# EAGLE design CocoMEMJr_v1.01 (EAGLE 7.7.0)

## Sheet 1 of 4: CPU
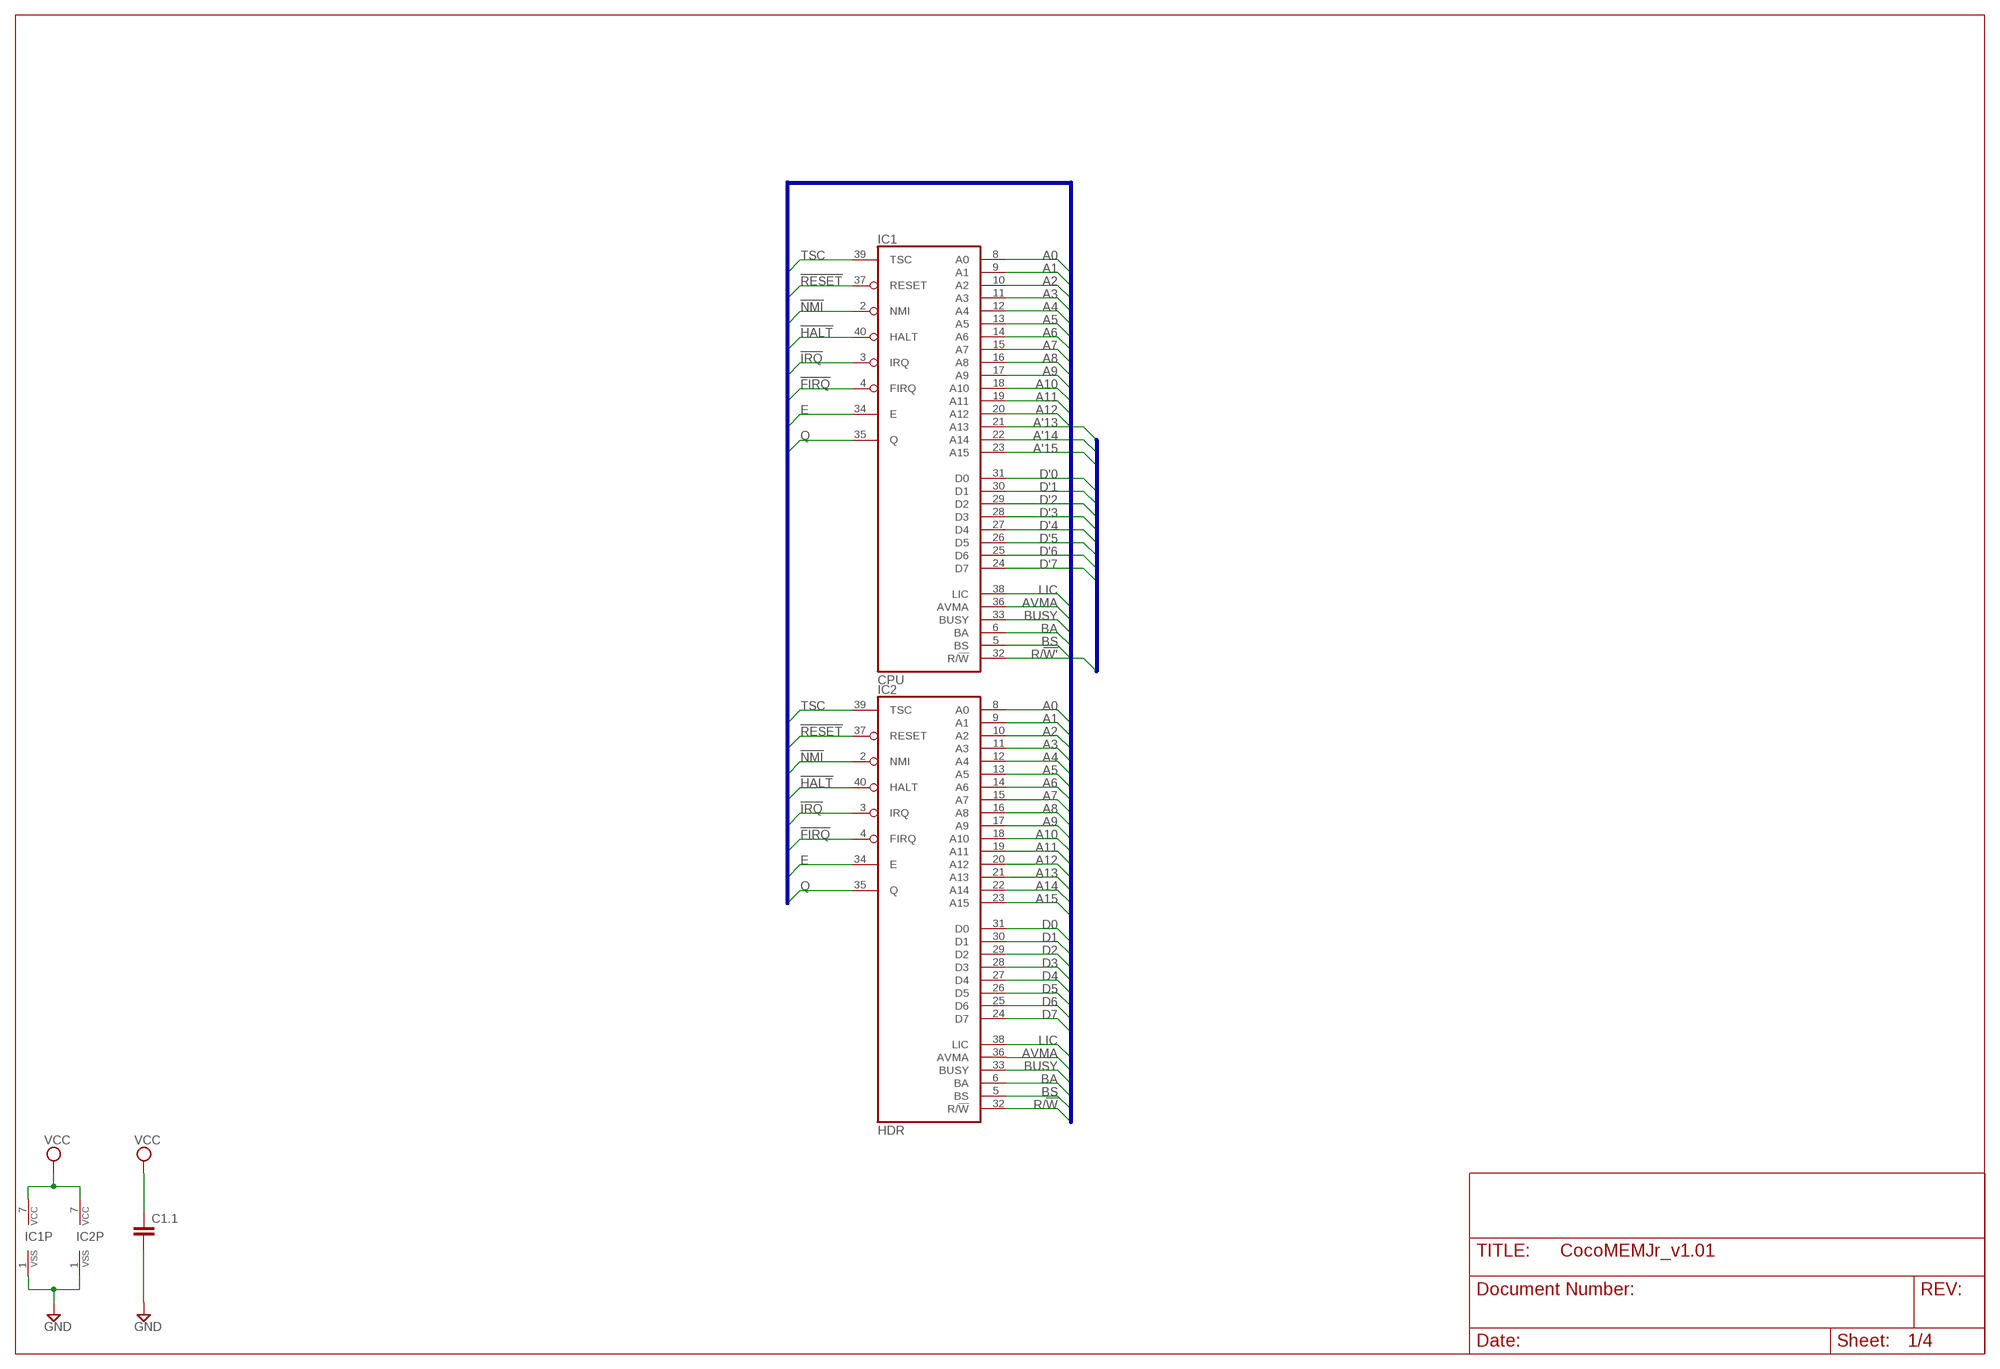
[diagram p0: schematic, sheet 1]

### Parts
C1.1  C-EUC0402  [C0402]
IC1  CPU  MC6809ER  [DIL40-ROUNDPAD]
IC2  HDR  MC6809ER  [DIL40-ROUNDPAD]

### Nets
!FIRQ: IC1.4(FIRQ) IC2.4(FIRQ) ; also sheet 2
!HALT: IC1.40(HALT) IC2.40(HALT) ; also sheet 2
!IRQ: IC1.3(IRQ) IC2.3(IRQ) ; also sheet 2
!NMI: IC1.2(NMI) IC2.2(NMI) ; also sheet 2
!RESET: IC1.37(RESET) IC2.37(RESET) ; also sheet 2
A0: IC1.8(A0) IC2.8(A0) ; also sheet 2
A1: IC1.9(A1) IC2.9(A1) ; also sheet 2
A2: IC1.10(A2) IC2.10(A2) ; also sheet 2
A3: IC1.11(A3) IC2.11(A3) ; also sheet 2
A4: IC1.12(A4) IC2.12(A4) ; also sheet 2
A5: IC1.13(A5) IC2.13(A5) ; also sheet 2
A6: IC1.14(A6) IC2.14(A6) ; also sheet 2
A7: IC1.15(A7) IC2.15(A7) ; also sheet 2
A8: IC1.16(A8) IC2.16(A8) ; also sheet 2
A9: IC1.17(A9) IC2.17(A9) ; also sheet 2
A10: IC1.18(A10) IC2.18(A10) ; also sheet 2
A11: IC1.19(A11) IC2.19(A11) ; also sheet 2
A12: IC1.20(A12) IC2.20(A12) ; also sheet 2
A13: IC2.21(A13) ; also sheet 2
A14: IC2.22(A14) ; also sheet 2
A15: IC2.23(A15) ; also sheet 2
A'13: IC1.21(A13) ; also sheet 2
A'14: IC1.22(A14) ; also sheet 2
A'15: IC1.23(A15) ; also sheet 2
AVMA: IC1.36(AVMA) IC2.36(AVMA)
BA: IC1.6(BA) IC2.6(BA) ; also sheet 2
BS: IC1.5(BS) IC2.5(BS) ; also sheet 2
BUSY: IC1.33(BUSY) IC2.33(BUSY) ; also sheet 2
D0: IC2.31(D0) ; also sheet 2
D1: IC2.30(D1) ; also sheet 2
D2: IC2.29(D2) ; also sheet 2
D3: IC2.28(D3) ; also sheet 2
D4: IC2.27(D4) ; also sheet 2
D5: IC2.26(D5) ; also sheet 2
D6: IC2.25(D6) ; also sheet 2
D7: IC2.24(D7) ; also sheet 2
D'0: IC1.31(D0) ; also sheet 2
D'1: IC1.30(D1) ; also sheet 2
D'2: IC1.29(D2) ; also sheet 2
D'3: IC1.28(D3) ; also sheet 2
D'4: IC1.27(D4) ; also sheet 2
D'5: IC1.26(D5) ; also sheet 2
D'6: IC1.25(D6) ; also sheet 2
D'7: IC1.24(D7) ; also sheet 2
E: IC1.34(E) IC2.34(E) ; also sheet 2
GND: C1.1.2 IC1.1(VSS) IC2.1(VSS) ; also sheet 2,3,4
LIC: IC1.38(LIC) IC2.38(LIC) ; also sheet 2
Q: IC1.35(Q) IC2.35(Q) ; also sheet 2
R/!W: IC2.32(R/!W) ; also sheet 2
R/!W': IC1.32(R/!W) ; also sheet 2
TSC: IC1.39(TSC) IC2.39(TSC) ; also sheet 2
VCC: C1.1.1 IC1.7(VCC) IC2.7(VCC) ; also sheet 4

### Buses
TSC,LIC,!RESET,!NMI,!HALT,!IRQ,!FIRQ,AVMA,BUSY,A[0..15],D[0..7],E,Q,BA,BS,R/!W
R/!W',D'[0..7],A'[13..15]

## Sheet 2 of 4: LOGIC
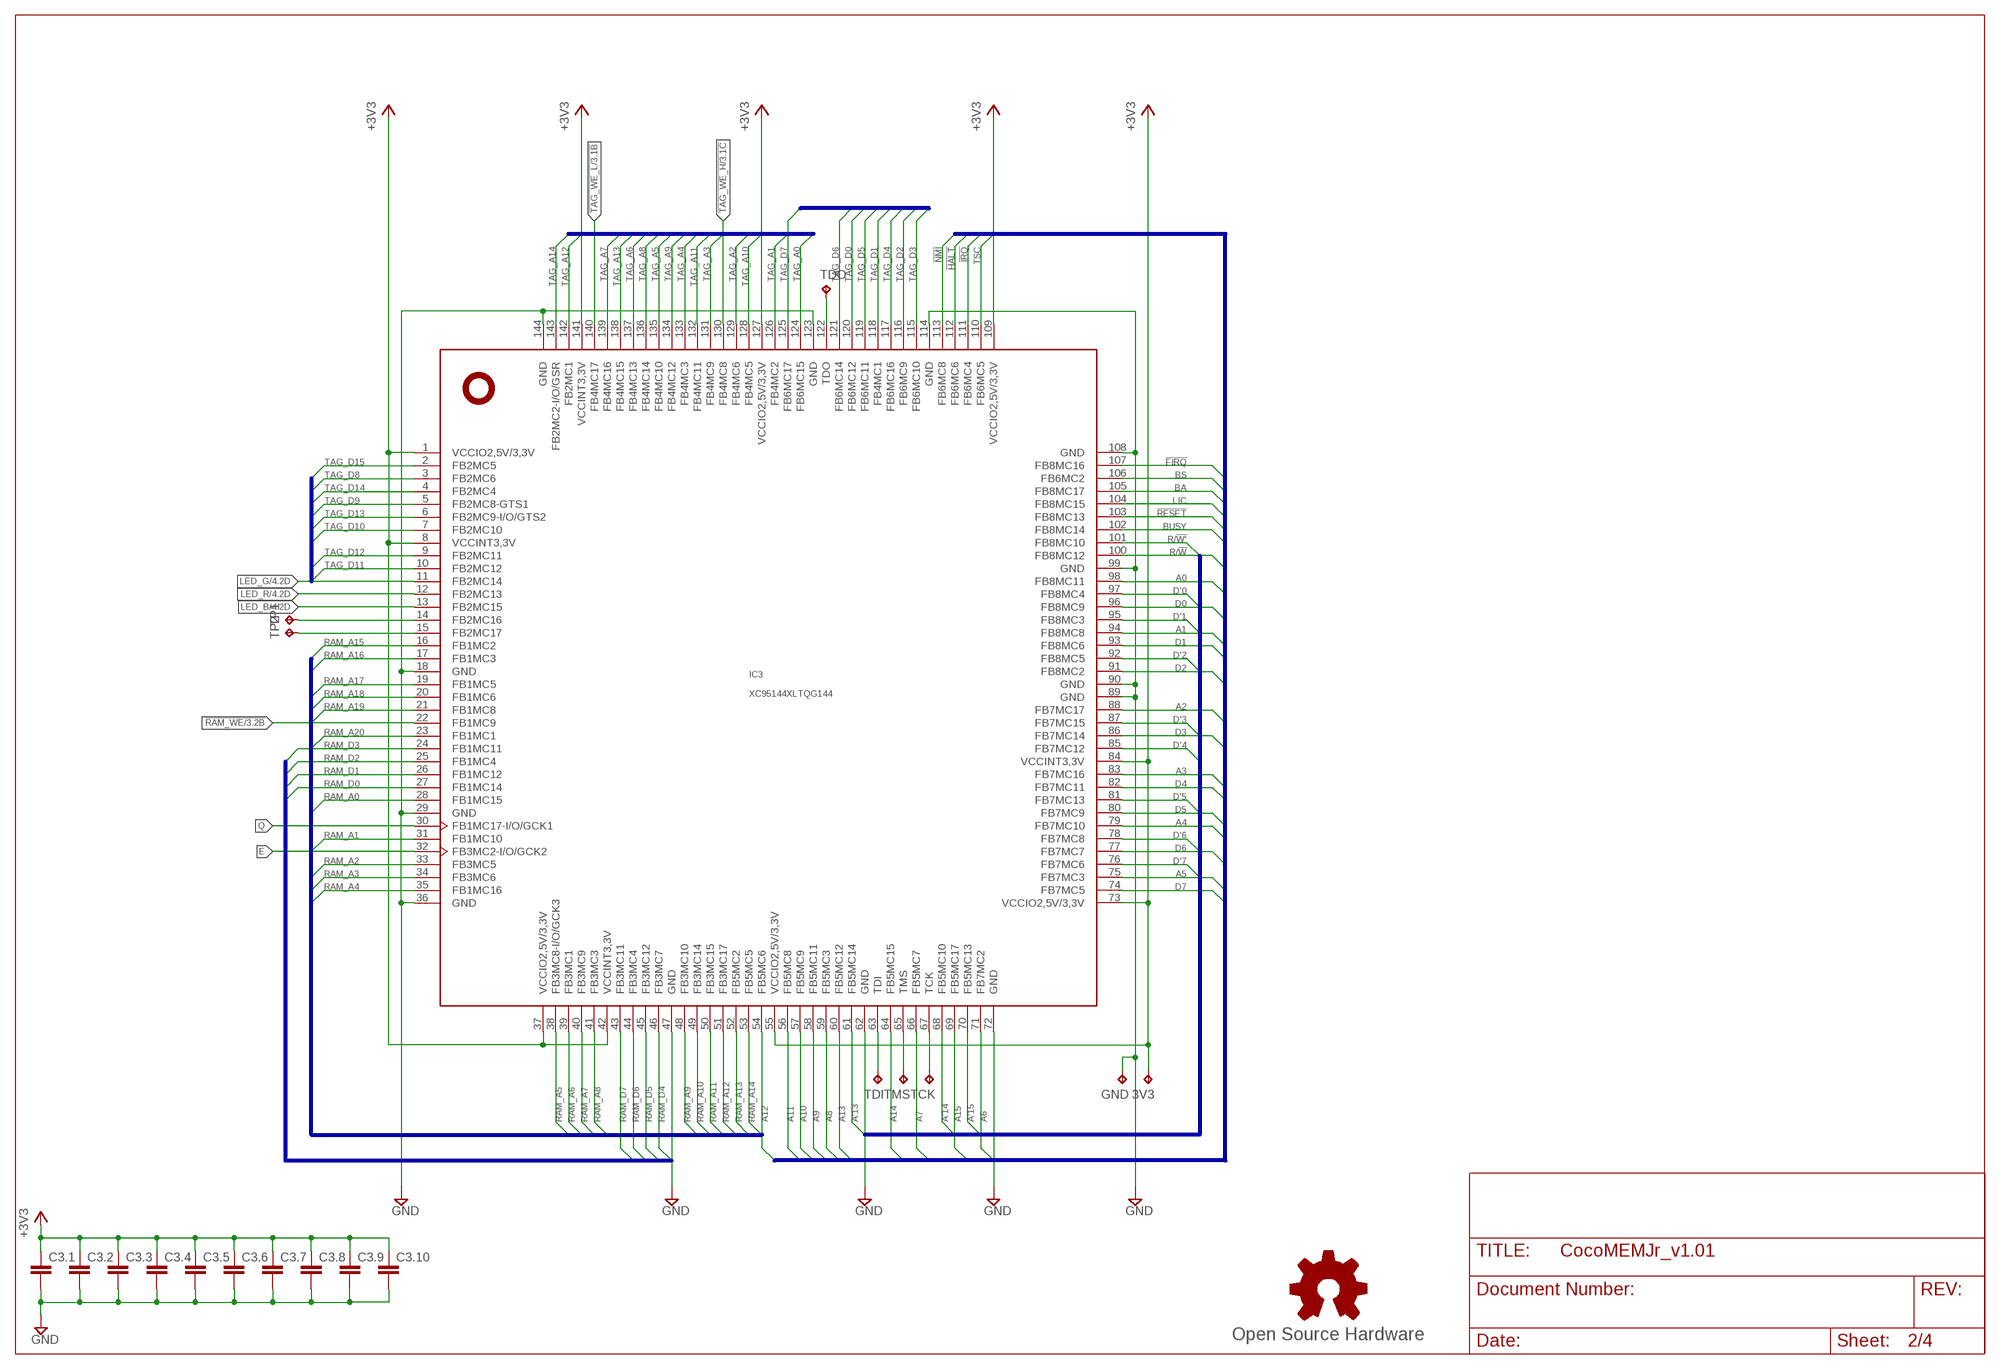
[diagram p1: schematic, sheet 2]

### Parts
3V3  TPTP08R  [TP08R]
C3.1  C-EUC0402  [C0402]
C3.2  C-EUC0402  [C0402]
C3.3  C-EUC0402  [C0402]
C3.4  C-EUC0402  [C0402]
C3.5  C-EUC0402  [C0402]
C3.6  C-EUC0402  [C0402]
C3.7  C-EUC0402  [C0402]
C3.8  C-EUC0402  [C0402]
C3.9  C-EUC0402  [C0402]
C3.10  C-EUC0402  [C0402]
GND  TPTP08R  [TP08R]
GOLD_ORB_SM1  Open Source Hardware  OSHWLOGOLOGO5MM  [OSHW_5MM]
IC3  XC95144XLTQG144  [TQFP144]
TCK  TPTP08R  [TP08R]
TDI  TPTP08R  [TP08R]
TDO  TPTP08R  [TP08R]
TMS  TPTP08R  [TP08R]
TP1  TPTP08R  [TP08R]
TP2  TPTP08R  [TP08R]

### Nets
!FIRQ: IC3.107(FB8MC16) ; also sheet 1
!HALT: IC3.112(FB6MC6) ; also sheet 1
!IRQ: IC3.111(FB6MC4) ; also sheet 1
!NMI: IC3.113(FB6MC8) ; also sheet 1
!RAM_WE: IC3.22(FB1MC9) ; also sheet 3
!RESET: IC3.103(FB8MC13) ; also sheet 1
!TAG_WE_H: IC3.130(FB4MC8) ; also sheet 3
!TAG_WE_L: IC3.140(FB4MC17) ; also sheet 3
+3V3: 3V3.TP C3.1.1 C3.2.1 C3.3.1 C3.4.1 C3.5.1 C3.6.1 C3.7.1 C3.8.1 C3.9.1 C3.10.1 IC3.1(VCCIO2,5V/3,3V) IC3.8(VCCINT3,3V) IC3.37(VCCIO2,5V/3,3V) IC3.42(VCCINT3,3V) IC3.55(VCCIO2,5V/3,3V) IC3.73(VCCIO2,5V/3,3V) IC3.84(VCCINT3,3V) IC3.109(VCCIO2,5V/3,3V) IC3.127(VCCIO2,5V/3,3V) IC3.141(VCCINT3,3V) ; also sheet 3,4
A0: IC3.98(FB8MC11) ; also sheet 1
A1: IC3.94(FB8MC8) ; also sheet 1
A2: IC3.88(FB7MC17) ; also sheet 1
A3: IC3.83(FB7MC16) ; also sheet 1
A4: IC3.79(FB7MC10) ; also sheet 1
A5: IC3.75(FB7MC3) ; also sheet 1
A6: IC3.71(FB7MC2) ; also sheet 1
A7: IC3.66(FB5MC7) ; also sheet 1
A8: IC3.59(FB5MC3) ; also sheet 1
A9: IC3.58(FB5MC11) ; also sheet 1
A10: IC3.57(FB5MC9) ; also sheet 1
A11: IC3.56(FB5MC8) ; also sheet 1
A12: IC3.54(FB5MC6) ; also sheet 1
A13: IC3.60(FB5MC12) ; also sheet 1
A14: IC3.64(FB5MC15) ; also sheet 1
A15: IC3.69(FB5MC17) ; also sheet 1
A'13: IC3.61(FB5MC14) ; also sheet 1
A'14: IC3.68(FB5MC10) ; also sheet 1
A'15: IC3.70(FB5MC13) ; also sheet 1
BA: IC3.105(FB8MC17) ; also sheet 1
BS: IC3.106(FB6MC2) ; also sheet 1
BUSY: IC3.102(FB8MC14) ; also sheet 1
D0: IC3.96(FB8MC9) ; also sheet 1
D1: IC3.93(FB8MC6) ; also sheet 1
D2: IC3.91(FB8MC2) ; also sheet 1
D3: IC3.86(FB7MC14) ; also sheet 1
D4: IC3.82(FB7MC11) ; also sheet 1
D5: IC3.80(FB7MC9) ; also sheet 1
D6: IC3.77(FB7MC7) ; also sheet 1
D7: IC3.74(FB7MC5) ; also sheet 1
D'0: IC3.97(FB8MC4) ; also sheet 1
D'1: IC3.95(FB8MC3) ; also sheet 1
D'2: IC3.92(FB8MC5) ; also sheet 1
D'3: IC3.87(FB7MC15) ; also sheet 1
D'4: IC3.85(FB7MC12) ; also sheet 1
D'5: IC3.81(FB7MC13) ; also sheet 1
D'6: IC3.78(FB7MC8) ; also sheet 1
D'7: IC3.76(FB7MC6) ; also sheet 1
E: IC3.32(FB3MC2-I/O/GCK2) ; also sheet 1
GND: C3.1.2 C3.2.2 C3.3.2 C3.4.2 C3.5.2 C3.6.2 C3.7.2 C3.8.2 C3.9.2 C3.10.2 GND.TP IC3.18(GND) IC3.29(GND) IC3.36(GND) IC3.47(GND) IC3.62(GND) IC3.72(GND) IC3.89(GND) IC3.90(GND) IC3.99(GND) IC3.108(GND) IC3.114(GND) IC3.123(GND) IC3.144(GND) ; also sheet 1,3,4
LED_B: IC3.13(FB2MC15) ; also sheet 4
LED_G: IC3.11(FB2MC14) ; also sheet 4
LED_R: IC3.12(FB2MC13) ; also sheet 4
LIC: IC3.104(FB8MC15) ; also sheet 1
N$4: IC3.14(FB2MC16) TP1.TP
N$5: IC3.63(TDI) TDI.TP
N$6: IC3.65(TMS) TMS.TP
N$7: IC3.67(TCK) TCK.TP
N$8: IC3.122(TDO) TDO.TP
N$9: IC3.15(FB2MC17) TP2.TP
Q: IC3.30(FB1MC17-I/O/GCK1) ; also sheet 1
R/!W: IC3.100(FB8MC12) ; also sheet 1
R/!W': IC3.101(FB8MC10) ; also sheet 1
RAM_A0: IC3.28(FB1MC15) ; also sheet 3
RAM_A1: IC3.31(FB1MC10) ; also sheet 3
RAM_A2: IC3.33(FB3MC5) ; also sheet 3
RAM_A3: IC3.34(FB3MC6) ; also sheet 3
RAM_A4: IC3.35(FB1MC16) ; also sheet 3
RAM_A5: IC3.38(FB3MC8-I/O/GCK3) ; also sheet 3
RAM_A6: IC3.39(FB3MC1) ; also sheet 3
RAM_A7: IC3.40(FB3MC9) ; also sheet 3
RAM_A8: IC3.41(FB3MC3) ; also sheet 3
RAM_A9: IC3.48(FB3MC10) ; also sheet 3
RAM_A10: IC3.49(FB3MC14) ; also sheet 3
RAM_A11: IC3.50(FB3MC15) ; also sheet 3
RAM_A12: IC3.51(FB3MC17) ; also sheet 3
RAM_A13: IC3.52(FB5MC2) ; also sheet 3
RAM_A14: IC3.53(FB5MC5) ; also sheet 3
RAM_A15: IC3.16(FB1MC2) ; also sheet 3
RAM_A16: IC3.17(FB1MC3) ; also sheet 3
RAM_A17: IC3.19(FB1MC5) ; also sheet 3
RAM_A18: IC3.20(FB1MC6) ; also sheet 3
RAM_A19: IC3.21(FB1MC8) ; also sheet 3
RAM_A20: IC3.23(FB1MC1) ; also sheet 3
RAM_D0: IC3.27(FB1MC14) ; also sheet 3
RAM_D1: IC3.26(FB1MC12) ; also sheet 3
RAM_D2: IC3.25(FB1MC4) ; also sheet 3
RAM_D3: IC3.24(FB1MC11) ; also sheet 3
RAM_D4: IC3.46(FB3MC7) ; also sheet 3
RAM_D5: IC3.45(FB3MC12) ; also sheet 3
RAM_D6: IC3.44(FB3MC4) ; also sheet 3
RAM_D7: IC3.43(FB3MC11) ; also sheet 3
TAG_A0: IC3.124(FB6MC15) ; also sheet 3
TAG_A1: IC3.126(FB4MC2) ; also sheet 3
TAG_A2: IC3.129(FB4MC6) ; also sheet 3
TAG_A3: IC3.131(FB4MC9) ; also sheet 3
TAG_A4: IC3.133(FB4MC3) ; also sheet 3
TAG_A5: IC3.135(FB4MC10) ; also sheet 3
TAG_A6: IC3.137(FB4MC13) ; also sheet 3
TAG_A7: IC3.139(FB4MC16) ; also sheet 3
TAG_A8: IC3.136(FB4MC14) ; also sheet 3
TAG_A9: IC3.134(FB4MC12) ; also sheet 3
TAG_A10: IC3.128(FB4MC5) ; also sheet 3
TAG_A11: IC3.132(FB4MC11) ; also sheet 3
TAG_A12: IC3.142(FB2MC1) ; also sheet 3
TAG_A13: IC3.138(FB4MC15) ; also sheet 3
TAG_A14: IC3.143(FB2MC2-I/O/GSR) ; also sheet 3
TAG_D0: IC3.120(FB6MC12) ; also sheet 3
TAG_D1: IC3.118(FB4MC1) ; also sheet 3
TAG_D2: IC3.116(FB6MC9) ; also sheet 3
TAG_D3: IC3.115(FB6MC10) ; also sheet 3
TAG_D4: IC3.117(FB6MC16) ; also sheet 3
TAG_D5: IC3.119(FB6MC11) ; also sheet 3
TAG_D6: IC3.121(FB6MC14) ; also sheet 3
TAG_D7: IC3.125(FB6MC17) ; also sheet 3
TAG_D8: IC3.3(FB2MC6) ; also sheet 3
TAG_D9: IC3.5(FB2MC8-GTS1) ; also sheet 3
TAG_D10: IC3.7(FB2MC10) ; also sheet 3
TAG_D11: IC3.10(FB2MC12) ; also sheet 3
TAG_D12: IC3.9(FB2MC11) ; also sheet 3
TAG_D13: IC3.6(FB2MC9-I/O/GTS2) ; also sheet 3
TAG_D14: IC3.4(FB2MC4) ; also sheet 3
TAG_D15: IC3.2(FB2MC5) ; also sheet 3
TSC: IC3.110(FB6MC5) ; also sheet 1

### Buses
TSC,LIC,!RESET,!NMI,!HALT,!IRQ,!FIRQ,AVMA,BUSY,A[0..15],D[0..7],E,Q,BA,BS,R/!W
R/!W',D'[0..7],A'[13..15]
RAM_D[0..7]
TAG_D[0..15]
TAG_A[0..14]
RAM_A[0..20]

## Sheet 3 of 4: MEMORY
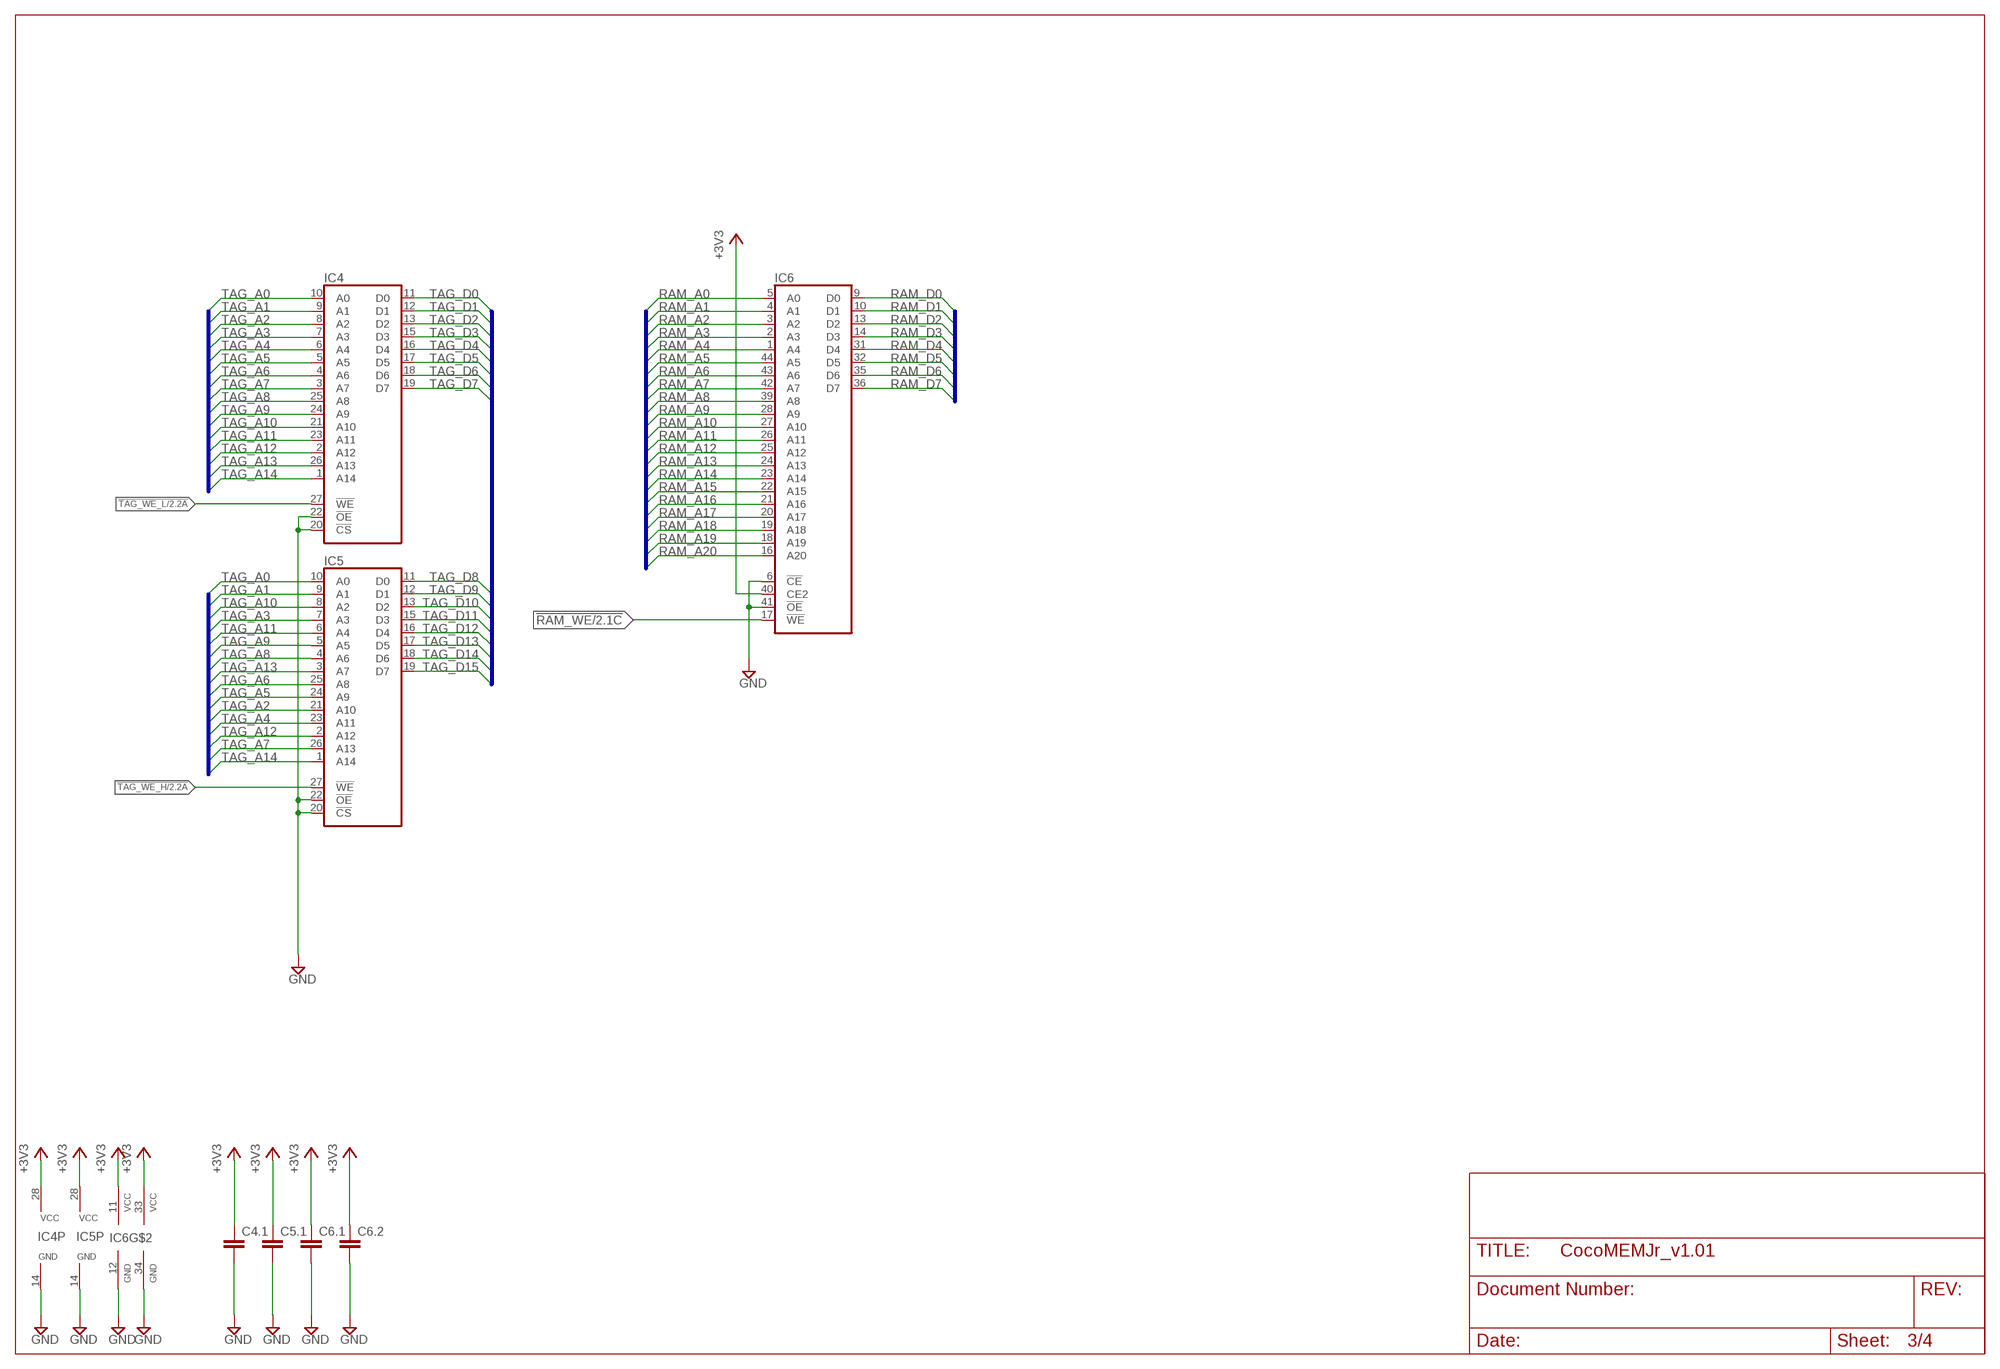
[diagram p2: schematic, sheet 3]

### Parts
C4.1  C-EUC0402  [C0402]
C5.1  C-EUC0402  [C0402]
C6.1  C-EUC0402  [C0402]
C6.2  C-EUC0402  [C0402]
IC4  JEDEC_32KB_SRAMY  [SOJ32/3]
IC5  JEDEC_32KB_SRAMY  [SOJ32/3]
IC6  AS6C1608-XXTIN  [TSOP44-II]

### Nets
!RAM_WE: IC6.17(!WE) ; also sheet 2
!TAG_WE_H: IC5.27(!WE) ; also sheet 2
!TAG_WE_L: IC4.27(!WE) ; also sheet 2
+3V3: C4.1.1 C5.1.1 C6.1.1 C6.2.1 IC4.28(VCC) IC5.28(VCC) IC6.11(VCC) IC6.33(VCC) IC6.40(CE2) ; also sheet 2,4
GND: C4.1.2 C5.1.2 C6.1.2 C6.2.2 IC4.14(GND) IC4.20(!CS) IC4.22(!OE) IC5.14(GND) IC5.20(!CS) IC5.22(!OE) IC6.6(!CE) IC6.12(GND) IC6.34(GND) IC6.41(!OE) ; also sheet 1,2,4
RAM_A0: IC6.5(A0) ; also sheet 2
RAM_A1: IC6.4(A1) ; also sheet 2
RAM_A2: IC6.3(A2) ; also sheet 2
RAM_A3: IC6.2(A3) ; also sheet 2
RAM_A4: IC6.1(A4) ; also sheet 2
RAM_A5: IC6.44(A5) ; also sheet 2
RAM_A6: IC6.43(A6) ; also sheet 2
RAM_A7: IC6.42(A7) ; also sheet 2
RAM_A8: IC6.39(A8) ; also sheet 2
RAM_A9: IC6.28(A9) ; also sheet 2
RAM_A10: IC6.27(A10) ; also sheet 2
RAM_A11: IC6.26(A11) ; also sheet 2
RAM_A12: IC6.25(A12) ; also sheet 2
RAM_A13: IC6.24(A13) ; also sheet 2
RAM_A14: IC6.23(A14) ; also sheet 2
RAM_A15: IC6.22(A15) ; also sheet 2
RAM_A16: IC6.21(A16) ; also sheet 2
RAM_A17: IC6.20(A17) ; also sheet 2
RAM_A18: IC6.19(A18) ; also sheet 2
RAM_A19: IC6.18(A19) ; also sheet 2
RAM_A20: IC6.16(A20) ; also sheet 2
RAM_D0: IC6.9(D0) ; also sheet 2
RAM_D1: IC6.10(D1) ; also sheet 2
RAM_D2: IC6.13(D2) ; also sheet 2
RAM_D3: IC6.14(D3) ; also sheet 2
RAM_D4: IC6.31(D4) ; also sheet 2
RAM_D5: IC6.32(D5) ; also sheet 2
RAM_D6: IC6.35(D6) ; also sheet 2
RAM_D7: IC6.36(D7) ; also sheet 2
TAG_A0: IC4.10(A0) IC5.10(A0) ; also sheet 2
TAG_A1: IC4.9(A1) IC5.9(A1) ; also sheet 2
TAG_A2: IC4.8(A2) IC5.21(A10) ; also sheet 2
TAG_A3: IC4.7(A3) IC5.7(A3) ; also sheet 2
TAG_A4: IC4.6(A4) IC5.23(A11) ; also sheet 2
TAG_A5: IC4.5(A5) IC5.24(A9) ; also sheet 2
TAG_A6: IC4.4(A6) IC5.25(A8) ; also sheet 2
TAG_A7: IC4.3(A7) IC5.26(A13) ; also sheet 2
TAG_A8: IC4.25(A8) IC5.4(A6) ; also sheet 2
TAG_A9: IC4.24(A9) IC5.5(A5) ; also sheet 2
TAG_A10: IC4.21(A10) IC5.8(A2) ; also sheet 2
TAG_A11: IC4.23(A11) IC5.6(A4) ; also sheet 2
TAG_A12: IC4.2(A12) IC5.2(A12) ; also sheet 2
TAG_A13: IC4.26(A13) IC5.3(A7) ; also sheet 2
TAG_A14: IC4.1(A14) IC5.1(A14) ; also sheet 2
TAG_D0: IC4.11(D0) ; also sheet 2
TAG_D1: IC4.12(D1) ; also sheet 2
TAG_D2: IC4.13(D2) ; also sheet 2
TAG_D3: IC4.15(D3) ; also sheet 2
TAG_D4: IC4.16(D4) ; also sheet 2
TAG_D5: IC4.17(D5) ; also sheet 2
TAG_D6: IC4.18(D6) ; also sheet 2
TAG_D7: IC4.19(D7) ; also sheet 2
TAG_D8: IC5.11(D0) ; also sheet 2
TAG_D9: IC5.12(D1) ; also sheet 2
TAG_D10: IC5.13(D2) ; also sheet 2
TAG_D11: IC5.15(D3) ; also sheet 2
TAG_D12: IC5.16(D4) ; also sheet 2
TAG_D13: IC5.17(D5) ; also sheet 2
TAG_D14: IC5.18(D6) ; also sheet 2
TAG_D15: IC5.19(D7) ; also sheet 2

### Buses
RAM_D[0..7]
TAG_D[0..15]
TAG_A[0..14]
RAM_A[0..20]

## Sheet 4 of 4: POWER
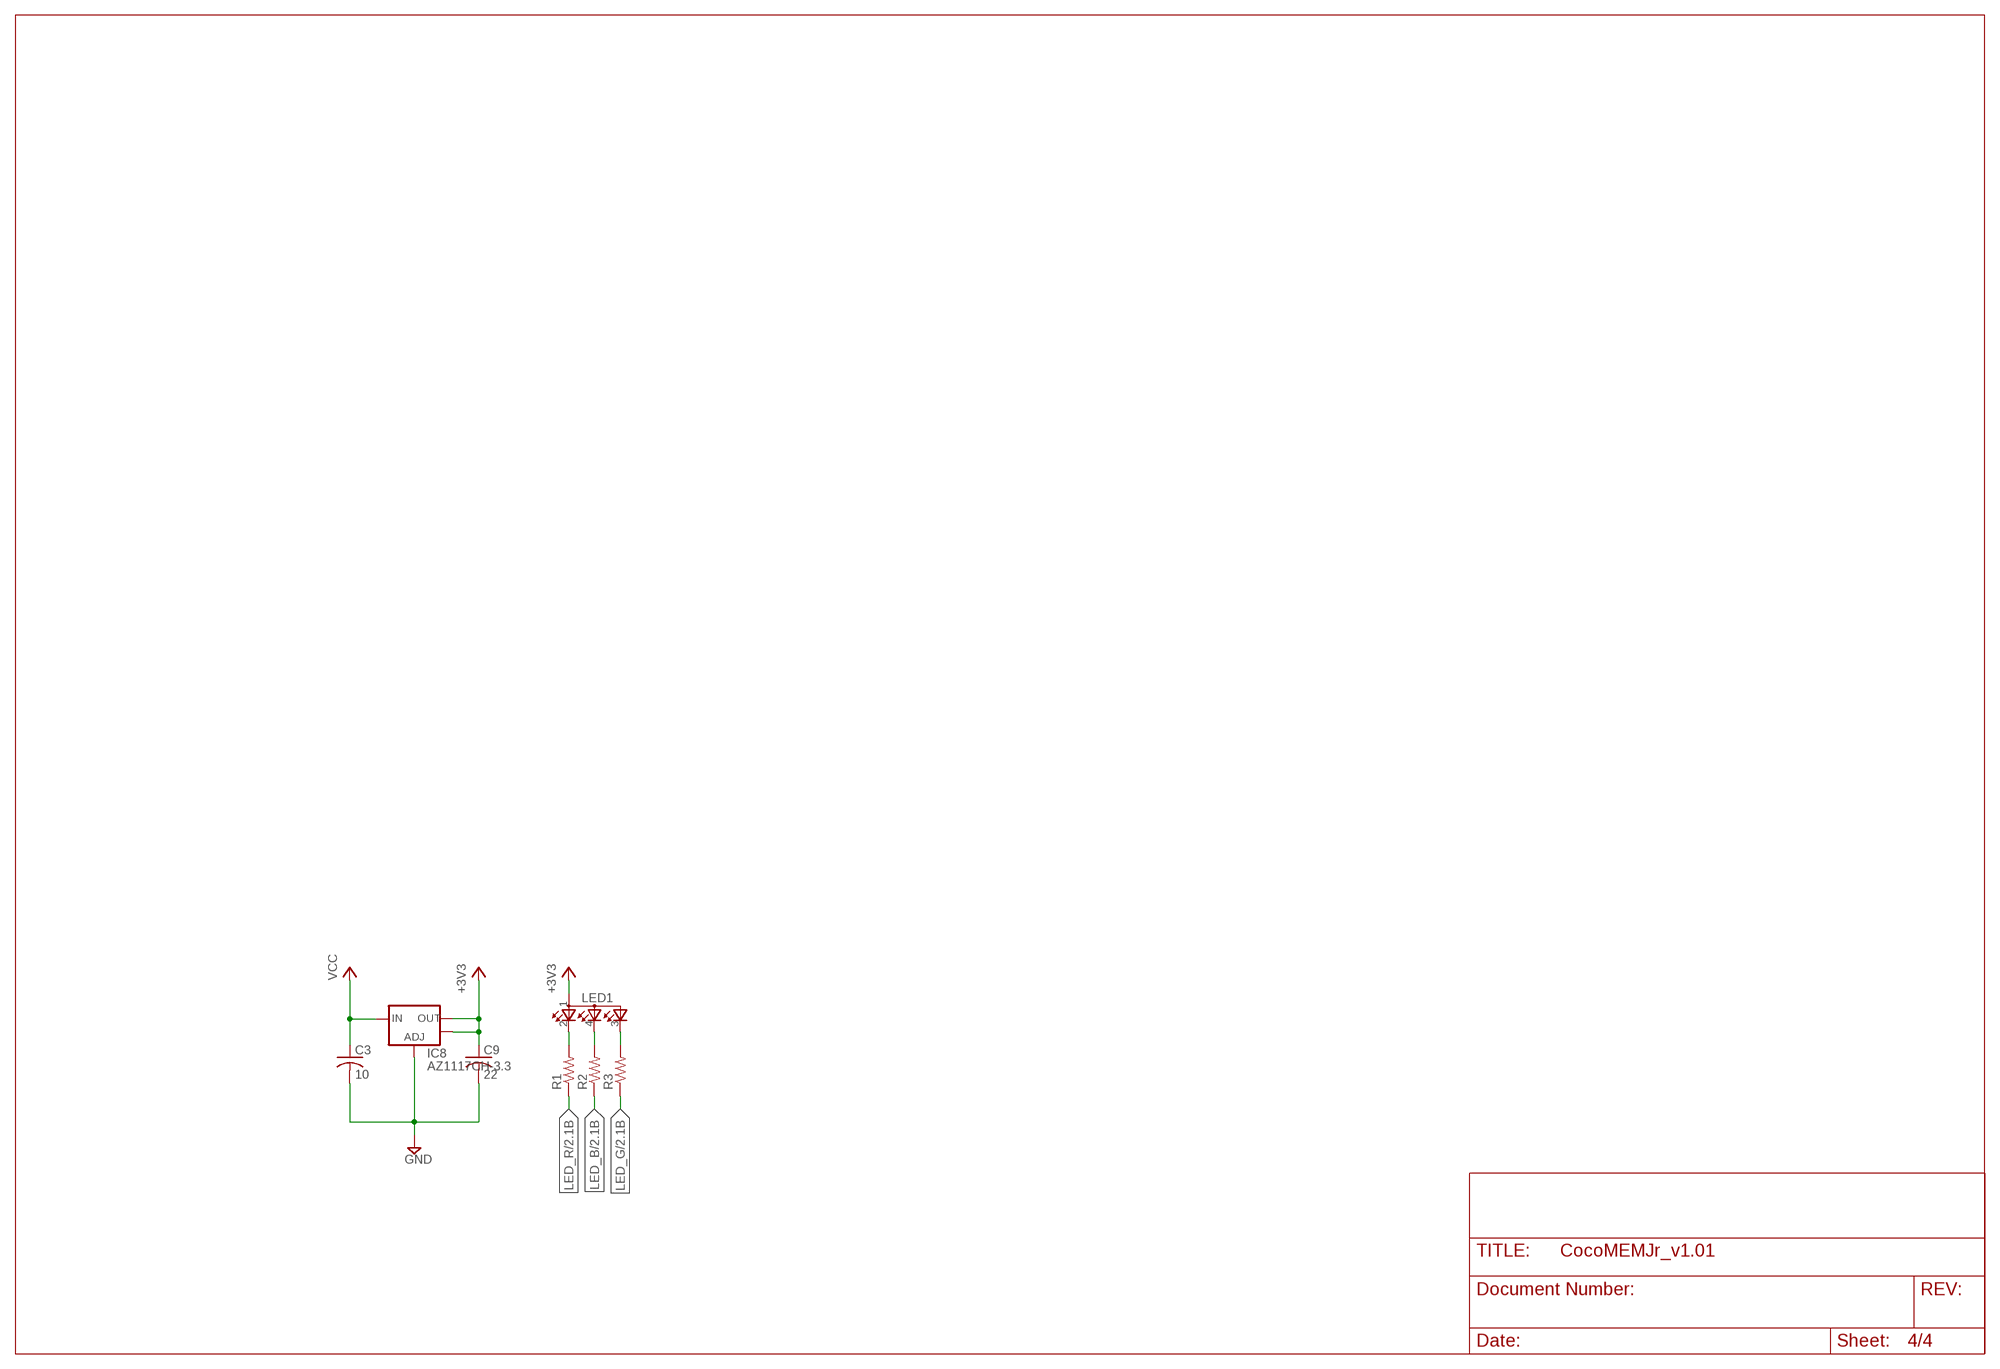
[diagram p3: schematic, sheet 4]

### Parts
C3  10  C-USC0805  [C0805]
C9  22  C-USC0805  [C0805]
IC8  AZ1117CH-3.3  V_REG_LM1117SOT223  [SOT223]
LED1  RGBLED-PLCC4  [PLCC-4]
R1  R-US_R0402  [R0402]
R2  R-US_R0402  [R0402]
R3  R-US_R0402  [R0402]

### Nets
+3V3: C9.1 IC8.2(OUT) IC8.4(OUT) LED1.1(A2) ; also sheet 2,3
GND: C3.2 C9.2 IC8.1(ADJ) ; also sheet 1,2,3
LED_B: R2.1 ; also sheet 2
LED_G: R3.1 ; also sheet 2
LED_R: R1.1 ; also sheet 2
N$1: LED1.2(CRED) R1.2
N$2: LED1.4(CBLUE) R2.2
N$3: LED1.3(CGREEN) R3.2
VCC: C3.1 IC8.3(IN) ; also sheet 1

## Library data of the parts
3V3 GND TCK TDI TDO TMS TP1 TP2 = testpad:TP: Test pad
C1.1 C3.1-C3.10 C4.1 C5.1 C6.1 C6.2 = rcl:C-EU: CAPACITOR, European symbol
C3 C9 = rcl:C-US: CAPACITOR, American symbol
GOLD_ORB_SM1 = oshw:OSHWLOGO: The OSHW logo for PCB layout
IC1 IC2 = micro-motorola:MC6809E: MICROCONTROLLER/MEMORY DEVICE
IC3 = xilinx_xc95XXXxl:XC95144XLTQG144
IC4 IC5 = memory-jedec-jlb:JEDEC_32KB_SRAM: MEMORY
IC6 = memory-alliance:AS6C1608-XX
IC8 = SparkFun:V_REG_LM1117: Voltage Regulator LM1117 Standard adjustable voltage regulator but in SMD form. Spark Fun Electronics SKU : COM-00595
LED1 = led-jlb:RGBLED-PLCC4: OSRAM - Hyper Multi TOPLED® (RGB) LB E673, LV E673, LT E673 - Power TOPLED® Enhanced optical Power LED (HOP2000) LS E67B, LA E67B, LO E67B, LY E67B - Hyper Multi TOPLED® Enhanced optical Power LED (HOP2000 / ATON®) LATB T66B - Hyper Multi TOPLED® Hyper-Bright LED LATB T686 Source: http://www.osram.convergy.de/
R1-R3 = resistor:R-US_: RESISTOR, American symbol

## Net classes
1 power: width 0.305 mm, drill 0.305 mm

## Board
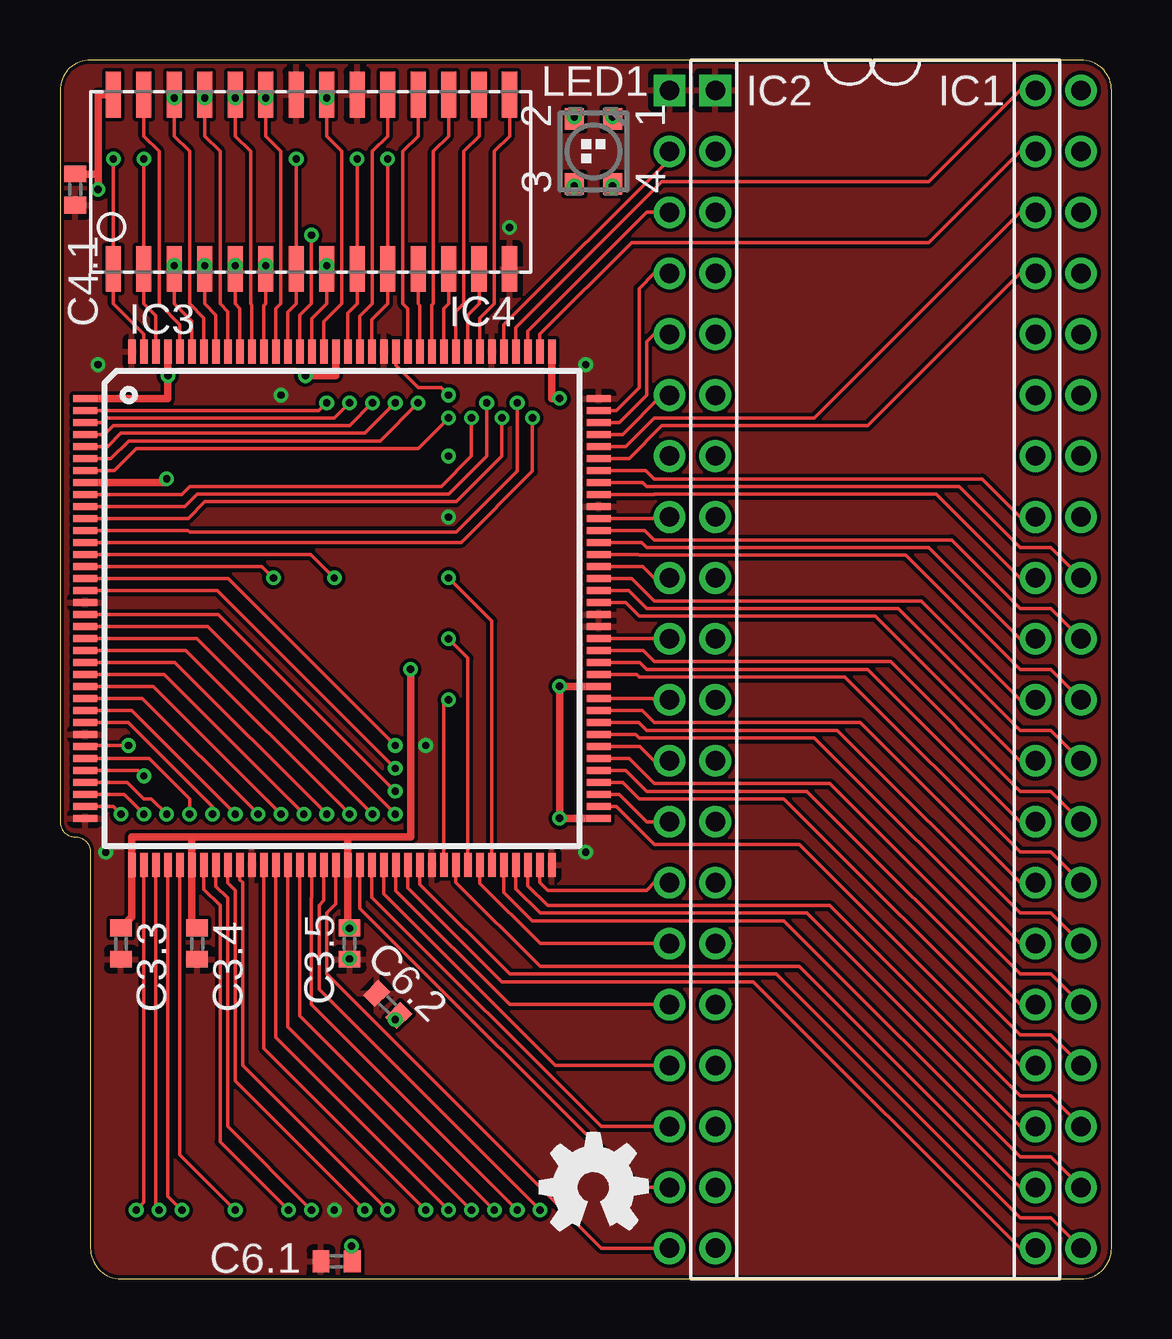
[diagram p4: board, top side]
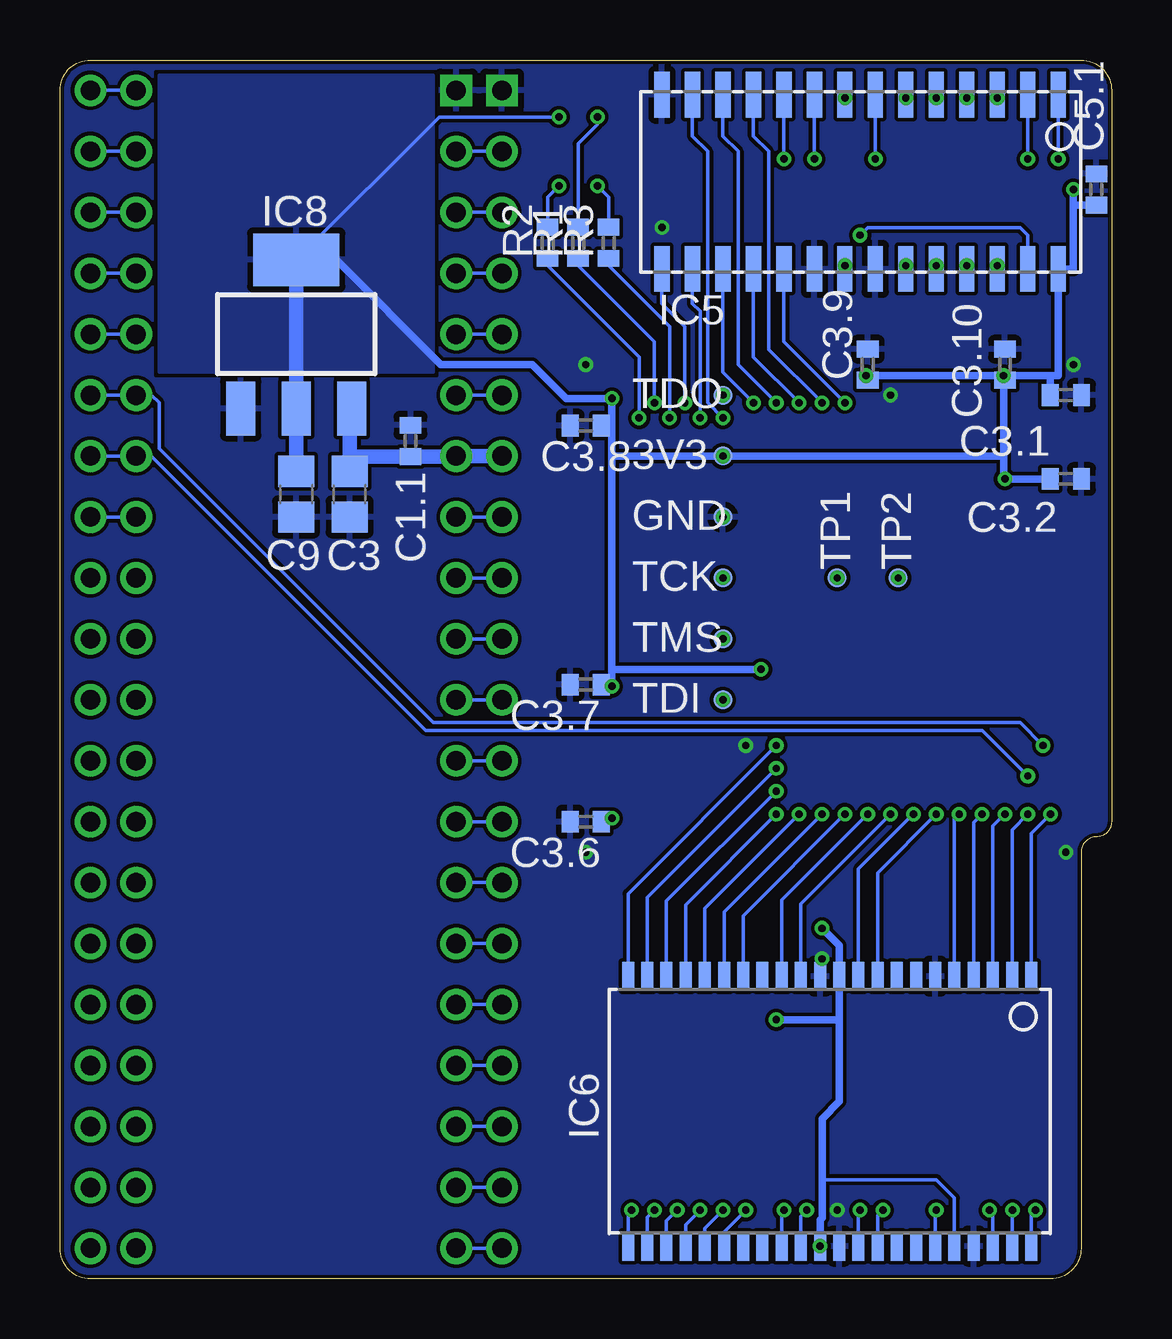
[diagram p5: board, bottom side, seen from below]

Size 43.81 x 50.8 mm. Coordinates in mm from the lower left corner, seen from the top.
Outline: 0,49.53 0,19.05 arc90 0.64,18.41 arc-90 1.27,17.78 1.27,1.27 arc90 2.54,0 42.55,0 arc90 43.81,1.27 43.81,49.53 arc90 42.55,50.8 1.27,50.8 arc90 0,49.53
Copper layers (1*16): Top 0.035mm / dielectric 1.5mm / Bottom 0.035mm
Design rules "hackvana *": minimum track width 6mil, minimum drill 0.3mm, track to track 6mil, track to pad 6mil, pad to pad 6mil, via to via 6mil, smd to smd 0mil, copper to edge 6mil, drill to drill 6mil, minimum pad ring 10mil, minimum via ring 6mil, stop-mask expansion 2mil, vias tented up to drill 100mil, thermal gap 10mil

### Footprints (pad centres in the part's own frame; a part is rotated, then mirrored left to right if it is on the bottom)
TP08R = smd 0.8 x 0.8: TP 0,0
C0402 = smd 0.7 x 0.9: 1 -0.65,0; 2 0.65,0
C0805 = smd 1.3 x 1.5: 1 -0.95,0; 2 0.95,0
DIL40-ROUNDPAD = drill 0.813 square: 1 -24.13,-7.62 | drill 0.813: 2 -21.59,-7.62; 3 -19.05,-7.62; 4 -16.51,-7.62; 5 -13.97,-7.62; 6 -11.43,-7.62; 7 -8.89,-7.62; 8 -6.35,-7.62; 9 -3.81,-7.62; 10 -1.27,-7.62; 11 1.27,-7.62; 12 3.81,-7.62; 13 6.35,-7.62; 14 8.89,-7.62; 15 11.43,-7.62; 16 13.97,-7.62; 17 16.51,-7.62; 18 19.05,-7.62; 19 21.59,-7.62; 20 24.13,-7.62; 21 24.13,7.62; 22 21.59,7.62; 23 19.05,7.62; 24 16.51,7.62; 25 13.97,7.62; 26 11.43,7.62; 27 8.89,7.62; 28 6.35,7.62; 29 3.81,7.62; 30 1.27,7.62; 31 -1.27,7.62; 32 -3.81,7.62; 33 -6.35,7.62; 34 -8.89,7.62; 35 -11.43,7.62; 36 -13.97,7.62; 37 -16.51,7.62; 38 -19.05,7.62; 39 -21.59,7.62; 40 -24.13,7.62
TQFP144 = smd 1 x 0.3: 1 -10.7,8.75; 2 -10.7,8.25; 3 -10.7,7.75; 4 -10.7,7.25; 5 -10.7,6.75; 6 -10.7,6.25; 7 -10.7,5.75; 8 -10.7,5.25; 9 -10.7,4.75; 10 -10.7,4.25; 11 -10.7,3.75; 12 -10.7,3.25; 13 -10.7,2.75; 14 -10.7,2.25; 15 -10.7,1.75; 16 -10.7,1.25; 17 -10.7,0.75; 18 -10.7,0.25; 19 -10.7,-0.25; 20 -10.7,-0.75; 21 -10.7,-1.25; 22 -10.7,-1.75; 23 -10.7,-2.25; 24 -10.7,-2.75; 25 -10.7,-3.25; 26 -10.7,-3.75; 27 -10.7,-4.25; 28 -10.7,-4.75; 29 -10.7,-5.25; 30 -10.7,-5.75; 31 -10.7,-6.25; 32 -10.7,-6.75; 33 -10.7,-7.25; 34 -10.7,-7.75; 35 -10.7,-8.25; 36 -10.7,-8.75; 73 10.7,-8.75; 74 10.7,-8.25; 75 10.7,-7.75; 76 10.7,-7.25; 77 10.7,-6.75; 78 10.7,-6.25; 79 10.7,-5.75; 80 10.7,-5.25; 81 10.7,-4.75; 82 10.7,-4.25; 83 10.7,-3.75; 84 10.7,-3.25; 85 10.7,-2.75; 86 10.7,-2.25; 87 10.7,-1.75; 88 10.7,-1.25; 89 10.7,-0.75; 90 10.7,-0.25; 91 10.7,0.25; 92 10.7,0.75; 93 10.7,1.25; 94 10.7,1.75; 95 10.7,2.25; 96 10.7,2.75; 97 10.7,3.25; 98 10.7,3.75; 99 10.7,4.25; 100 10.7,4.75; 101 10.7,5.25; 102 10.7,5.75; 103 10.7,6.25; 104 10.7,6.75; 105 10.7,7.25; 106 10.7,7.75; 107 10.7,8.25; 108 10.7,8.75 | smd 0.3 x 1: 37 -8.75,-10.7; 38 -8.25,-10.7; 39 -7.75,-10.7; 40 -7.25,-10.7; 41 -6.75,-10.7; 42 -6.25,-10.7; 43 -5.75,-10.7; 44 -5.25,-10.7; 45 -4.75,-10.7; 46 -4.25,-10.7; 47 -3.75,-10.7; 48 -3.25,-10.7; 49 -2.75,-10.7; 50 -2.25,-10.7; 51 -1.75,-10.7; 52 -1.25,-10.7; 53 -0.75,-10.7; 54 -0.25,-10.7; 55 0.25,-10.7; 56 0.75,-10.7; 57 1.25,-10.7; 58 1.75,-10.7; 59 2.25,-10.7; 60 2.75,-10.7; 61 3.25,-10.7; 62 3.75,-10.7; 63 4.25,-10.7; 64 4.75,-10.7; 65 5.25,-10.7; 66 5.75,-10.7; 67 6.25,-10.7; 68 6.75,-10.7; 69 7.25,-10.7; 70 7.75,-10.7; 71 8.25,-10.7; 72 8.75,-10.7; 109 8.75,10.7; 110 8.25,10.7; 111 7.75,10.7; 112 7.25,10.7; 113 6.75,10.7; 114 6.25,10.7; 115 5.75,10.7; 116 5.25,10.7; 117 4.75,10.7; 118 4.25,10.7; 119 3.75,10.7; 120 3.25,10.7; 121 2.75,10.7; 122 2.25,10.7; 123 1.75,10.7; 124 1.25,10.7; 125 0.75,10.7; 126 0.25,10.7; 127 -0.25,10.7; 128 -0.75,10.7; 129 -1.25,10.7; 130 -1.75,10.7; 131 -2.25,10.7; 132 -2.75,10.7; 133 -3.25,10.7; 134 -3.75,10.7; 135 -4.25,10.7; 136 -4.75,10.7; 137 -5.25,10.7; 138 -5.75,10.7; 139 -6.25,10.7; 140 -6.75,10.7; 141 -7.25,10.7; 142 -7.75,10.7; 143 -8.25,10.7; 144 -8.75,10.7
SOJ32/3 = smd 0.635 x 1.905: 1 -8.255,-3.632; 2 -6.985,-3.632; 3 -5.715,-3.632; 4 -4.445,-3.632; 5 -3.175,-3.632; 6 -1.905,-3.632; 7 -0.635,-3.632; 8 0.635,-3.632; 9 1.905,-3.632; 10 3.175,-3.632; 11 4.445,-3.632; 12 5.715,-3.632; 13 6.985,-3.632; 14 8.255,-3.632; 15 8.255,3.632; 16 6.985,3.632; 17 5.715,3.632; 18 4.445,3.632; 19 3.175,3.632; 20 1.905,3.632; 21 0.635,3.632; 22 -0.635,3.632; 23 -1.905,3.632; 24 -3.175,3.632; 25 -4.445,3.632; 26 -5.715,3.632; 27 -6.985,3.632; 28 -8.255,3.632
TSOP44-II = smd 0.5 x 1.2: 1 -8.4,-5.627; 2 -7.6,-5.627; 3 -6.8,-5.627; 4 -6,-5.627; 5 -5.2,-5.627; 6 -4.4,-5.627; 7 -3.6,-5.627; 8 -2.8,-5.627; 9 -2,-5.627; 10 -1.2,-5.627; 11 -0.4,-5.627; 12 0.4,-5.627; 13 1.2,-5.627; 14 2,-5.627; 15 2.8,-5.627; 16 3.6,-5.627; 17 4.4,-5.627; 18 5.2,-5.627; 19 6,-5.627; 20 6.8,-5.627; 21 7.6,-5.627; 22 8.4,-5.627; 23 8.4,5.627; 24 7.6,5.627; 25 6.8,5.627; 26 6,5.627; 27 5.2,5.627; 28 4.4,5.627; 29 3.6,5.627; 30 2.8,5.627; 31 2,5.627; 32 1.2,5.627; 33 0.4,5.627; 34 -0.4,5.627; 35 -1.2,5.627; 36 -2,5.627; 37 -2.8,5.627; 38 -3.6,5.627; 39 -4.4,5.627; 40 -5.2,5.627; 41 -6,5.627; 42 -6.8,5.627; 43 -7.6,5.627; 44 -8.4,5.627
SOT223 = smd 1.219 x 2.235: 1 -2.311,-3.099; 2 0,-3.099; 3 2.311,-3.099 | smd 3.6 x 2.2: 4 0,3.099
PLCC-4 = smd 0.9 x 0.8: 1 1.35,-0.8; 2 1.35,0.8; 3 -1.35,0.8; 4 -1.35,-0.8
R0402 = smd 0.7 x 0.9: 1 -0.65,0; 2 0.65,0

### Placement (x,y rotation side)
3V3  16.19,34.29 0 bottom
C1.1  29.21,34.92 90 bottom
C3  31.75,32.7 270 bottom
C3.1  1.91,36.83 0 bottom
C3.2  1.91,33.34 0 bottom
C3.3  2.54,13.97 270 top
C3.4  5.71,13.97 270 top
C3.5  12.06,13.97 270 top
C3.6  21.91,19.05 180 bottom
C3.7  21.91,24.77 180 bottom
C3.8  21.91,35.56 180 bottom
C3.9  10.16,38.1 90 bottom
C3.10  4.45,38.1 90 bottom
C4.1  0.64,45.4 270 top
C5.1  0.64,45.4 90 bottom
C6.1  11.52,0.73 180 top
C6.2  13.65,11.43 135 top
C9  33.97,32.7 270 bottom
GND  16.19,31.75 0 bottom
GOLD_ORB_SM1  22.23,3.81 0 top
IC1  34.92,25.4 270 top
IC2  33.02,25.4 270 top
IC3  11.75,27.94 0 top
IC4  10.48,45.72 0 top
IC5  10.48,45.72 180 bottom
IC6  11.75,6.99 180 bottom
IC8  33.97,39.37 0 bottom
LED1  22.23,46.99 90 top
R1  22.23,43.18 90 bottom
R2  23.5,43.18 90 bottom
R3  20.95,43.18 90 bottom
TCK  16.19,29.21 0 bottom
TDI  16.19,24.13 0 bottom
TDO  16.19,36.83 0 bottom
TMS  16.19,26.67 0 bottom
TP1  11.43,29.21 0 bottom
TP2  8.89,29.21 0 bottom

### Tracks (layer width: path | path; a pad name or v marks a point on that pad's centre or on a via)
!FIRQ
  Top 0.152: IC3.107 23.17,36.19 24.13,37.15 24.13,41.27 24.77,41.91 IC2.4
  Bottom 0.152: IC1.4 IC2.4
!HALT
  Top 0.152: IC3.112 19,39.63 25.08,45.72 36.2,45.72 40.01,49.53 IC2.40
  Bottom 0.152: IC1.40 IC2.40
!IRQ
  Top 0.152: IC2.3 24.45,44.45 19.5,39.5 IC3.111
  Bottom 0.152: IC1.3 IC2.3
!NMI
  Top 0.152: IC3.113 18.5,39.77 25.4,46.67 IC2.2
  Bottom 0.152: IC1.2 IC2.2
!RAM_WE  (via drill 0.3)
  Top 0.152: IC3.22 5.24,26.19 v12.06,19.37
  Bottom 0.152: v12.06,19.37 16.15,15.29 IC6.17
!RESET
  Top 0.152: IC3.103 23.71,34.19 25.08,35.56 33.66,35.56 40.01,41.91 IC2.37
  Bottom 0.152: IC1.37 IC2.37
!TAG_WE_H  (via drill 0.3)
  Top 0.152: v10.48,43.5 10.48,40.64 10,40.16 IC3.130
  Bottom 0.152: IC5.27 3.49,43.5 3.81,43.81 10.16,43.81 v10.48,43.5
!TAG_WE_L
  Top 0.152: IC3.140 5,39.77 4.13,40.64 4.13,46.99 3.49,47.62 IC4.27
+3V3  (via drill 0.3)
  Top 0.152: LED1.1 v23.02,48.42
  Top 0.305: IC3.8 4.45,33.19 v4.45,33.34 | IC3.141 v4.5,37.64 4.5,36.69 IC3.1 | IC3.73 v20.82,19.19 v20.82,24.69 IC3.84 | 5.5,18.41 3,18.41 IC3.37 3,15.08 C3.3.1 | 5.5,18.41 IC3.42 5.5,14.84 C3.4.1 | 12,18.41 IC3.55 12,14.69 C3.5.1 v12.06,14.61 | 12,18.41 5.5,18.41 | 12,18.41 14.61,18.41 v14.61,25.4 | C6.2.1 13.97,10.83 v13.97,10.79 | C4.1.1 0.64,46.04 1.59,46.04 | 1.59,46.04 v1.59,45.4 | IC4.28 1.59,49.35 1.59,46.04 | IC3.127 11.5,37.64 v10.23,37.64 | C6.1.1 12.17,1.33 IC6.33 | IC3.109 20.5,36.69 v20.82,36.69
  Bottom 0.152: IC6.40 6.55,3.37 7.3,4.13 12.06,4.13 12.06,3.81 | IC8.4 28.02,48.42 v23.02,48.42
  Bottom 0.305: 4.5,34.29 4.5,33.34 v4.45,33.34 C3.2.1 | 4.5,34.29 v4.5,37.64 | v4.5,37.64 v10.23,37.64 10.16,37.64 C3.9.1 | 20.82,25.4 20.82,34.29 | 20.82,34.29 20.82,35.56 | 20.82,35.56 v20.82,36.69 22.72,36.69 24.13,38.1 27.94,38.1 32.31,42.47 IC8.4 | C3.7.1 21.26,24.69 v20.82,24.69 20.82,25.4 | v20.82,19.19 20.82,19.05 C3.6.1 | 2.56,36.69 C3.1.1 2.56,37.64 | v12.06,14.61 11.35,13.89 IC6.11 11.35,10.79 | IC6.33 12.15,2.46 12.06,2.54 12.06,3.81 12.06,6.67 11.35,7.38 11.35,10.79 | v13.97,10.79 11.35,10.79 | 20.82,34.29 3V3.TP 4.5,34.29 | v14.61,25.4 20.82,25.4 | v1.59,45.4 1.59,44.75 | 1.59,44.75 C5.1.1 | 1.59,44.75 1.59,42.09 IC5.28 2.22,37.64 2.56,37.64 | 2.56,37.64 v4.5,37.64 | C3.10.1 4.45,37.64 v4.5,37.64 | C3.8.1 20.82,35.56
  Bottom 0.61: C9.1 IC8.2 IC8.4
  other vias: 16.19,34.29 12.15,1.36
  pour Bottom: 39.69,50.16 28.26,50.16 28.26,37.78 39.69,37.78
A0
  Top 0.152: IC2.8 24.77,31.75 24.7,31.69 IC3.98
  Bottom 0.152: IC1.8 IC2.8
A1
  Top 0.152: 25.08,29.21 IC2.9 24.77,29.21 24.29,29.69 IC3.94
  Bottom 0.152: IC1.9 IC2.9
A2
  Top 0.152: IC3.88 24.75,26.69 24.77,26.67 IC2.10
  Bottom 0.152: IC1.10 IC2.10
A3
  Top 0.152: IC2.11 24.77,24.13 24.7,24.19 IC3.83
  Bottom 0.152: IC1.11 IC2.11
A4
  Top 0.152: IC2.12 24.77,21.59 24.16,22.19 IC3.79
  Bottom 0.152: IC1.12 IC2.12
A5
  Top 0.152: IC3.75 23.31,20.19 24.45,19.05 IC2.13
  Bottom 0.152: IC1.13 IC2.13
A6
  Top 0.152: 25.08,16.51 IC2.14 24.77,16.51 24.45,16.19 20.32,16.19 20,16.52 IC3.71
  Bottom 0.152: IC1.14 IC2.14
A7
  Top 0.152: IC1.15 27.94,13.97 | IC3.66 17.5,16.48 20,13.97 IC2.15
  Bottom 0.152: IC1.15 IC2.15
A8
  Top 0.152: IC1.16 27.94,11.43 | IC3.59 14,16.16 18.73,11.43 IC2.16
  Bottom 0.152: IC1.16 IC2.16
A9
  Top 0.152: IC3.58 13.5,16.03 20.64,8.89 IC2.17
  Bottom 0.152: IC1.17 IC2.17
A10
  Top 0.152: IC3.57 13,15.89 22.54,6.35 IC2.18
  Bottom 0.152: IC1.18 IC2.18
A11
  Top 0.152: IC3.56 12.5,15.44 24.13,3.81 IC2.19
  Bottom 0.152: IC1.19 IC2.19
A12
  Top 0.152: IC3.54 11.5,15.62 11.11,15.24 11.11,12.7 22.54,1.27 IC2.20
  Bottom 0.152: IC1.20 IC2.20
A13
  Top 0.152: IC2.21 40.01,1.27 28.89,12.38 18.41,12.38 14.5,16.3 IC3.60
A14
  Top 0.152: IC2.22 40.01,3.81 30.8,13.02 20,13.02 16.5,16.52 IC3.64
A15
  Top 0.152: IC2.23 40.01,6.35 31.11,15.24 20,15.24 19,16.25 IC3.69
A'13
  Top 0.152: IC1.21 41.27,2.54 40.01,2.54 29.84,12.7 18.73,12.7 15,16.43 IC3.61
A'14
  Top 0.152: IC1.22 41.27,5.08 40.01,5.08 30.16,14.92 19.68,14.92 18.5,16.11 IC3.68
A'15
  Top 0.152: IC1.23 41.27,7.62 40.01,7.62 32.07,15.56 20.32,15.56 19.5,16.38 IC3.70
AVMA
  Bottom 0.152: IC1.36 IC2.36
BA
  Top 0.152: IC3.105 23.44,35.19 25.08,36.83 IC2.6
  Bottom 0.152: IC1.6 IC2.6
BS
  Top 0.152: IC3.106 23.31,35.69 24.45,36.83 24.45,39.05 24.77,39.37 IC2.5
  Bottom 0.152: IC1.5 IC2.5
BUSY
  Top 0.152: IC3.102 24.41,33.69 24.77,33.34 38.42,33.34 40.01,31.75 IC2.33
  Bottom 0.152: IC1.33 IC2.33
D0
  Top 0.152: IC2.31 40.01,26.67 36.2,30.48 24.45,30.48 24.24,30.69 IC3.96
D1
  Top 0.152: IC2.30 40.01,24.13 35.88,28.26 24.77,28.26 23.83,29.19 IC3.93
D2
  Top 0.152: IC2.29 40.01,21.59 33.97,27.62 24.13,27.62 23.56,28.19 IC3.91
D3
  Top 0.152: IC2.28 40.01,19.05 33.66,25.4 24.45,25.4 24.16,25.69 IC3.86
D4
  Top 0.152: IC2.27 40.01,16.51 33.34,23.18 24.77,23.18 24.25,23.69 IC3.82
D5
  Top 0.152: IC2.26 40.01,13.97 31.43,22.54 24.13,22.54 23.98,22.69 IC3.80
D6
  Top 0.152: IC2.25 40.01,11.43 31.11,20.32 24.45,20.32 23.58,21.19 IC3.77
D7
  Top 0.152: IC2.24 40.01,8.89 30.8,18.1 24.77,18.1 23.17,19.69 IC3.74
D'0
  Top 0.152: IC1.31 41.27,27.94 40.01,27.94 37.15,30.8 24.77,30.8 24.37,31.19 IC3.97
D'1
  Top 0.152: IC1.30 41.27,25.4 40.01,25.4 35.24,30.16 24.13,30.16 24.1,30.19 IC3.95
D'2
  Top 0.152: IC1.29 41.27,22.86 40.01,22.86 34.92,27.94 24.45,27.94 23.7,28.69 IC3.92
D'3
  Top 0.152: IC1.28 41.27,20.32 40.01,20.32 34.61,25.72 24.77,25.72 24.29,26.19 IC3.87
D'4
  Top 0.152: IC1.27 41.27,17.78 40.01,17.78 32.7,25.08 24.13,25.08 24.02,25.19 IC3.85
D'5
  Top 0.152: IC1.26 41.27,15.24 40.01,15.24 32.38,22.86 24.45,22.86 24.12,23.19 IC3.81
D'6
  Top 0.152: IC1.25 41.27,12.7 40.01,12.7 32.07,20.64 24.77,20.64 23.71,21.69 IC3.78
D'7
  Top 0.152: IC1.24 41.27,10.16 40.01,10.16 30.16,20 24.13,20 23.44,20.69 IC3.76
E  (via drill 0.3)
  Top 0.152: IC3.32 3.26,21.19 v3.49,20.95
  Bottom 0.152: IC1.34 IC2.34 40.01,34.29 28.57,22.86 5.4,22.86 v3.49,20.95
GND  (via drill 0.3)
  other vias: 16.19,31.75 1.59,38.1 21.91,38.1 1.91,17.78 21.91,17.78 12.06,13.34 18.73,43.81 15.24,22.23 11.43,2.86 9.21,36.83
  pour Bottom (rank 2): 1.27,50.8 42.55,50.8 arc-90 43.81,49.53 43.81,1.27 arc-90 42.55,0 2.54,0 arc-90 1.27,1.27 1.27,17.78 arc90 0.64,18.41 arc-90 0,19.05 0,49.53 arc-90
  pour Top: 1.27,50.8 42.55,50.8 arc-90 43.81,49.53 43.81,1.27 arc-90 42.55,0 2.54,0 arc-90 1.27,1.27 1.27,17.78 arc90 0.64,18.41 arc-90 0,19.05 0,49.53 arc-90
LED_B  (via drill 0.3)
  Top 0.152: IC3.13 16.72,30.69 19.68,33.66 v19.68,35.88
  Bottom 0.152: R2.1 23.5,42.23 19.68,38.42 v19.68,35.88
LED_G  (via drill 0.3)
  Top 0.152: IC3.11 5.34,31.69 6.03,32.38 16.51,32.38 18.41,34.29 v18.41,35.88
  Bottom 0.152: R3.1 20.95,42.23 18.41,39.69 v18.41,35.88
LED_R  (via drill 0.3)
  Top 0.152: v19.05,36.51 19.05,33.66 16.51,31.11 5.4,31.11 5.32,31.19 IC3.12
  Bottom 0.152: R1.1 22.23,42.23 19.05,39.05 v19.05,36.51
LIC
  Top 0.152: IC3.104 23.58,34.69 24.77,35.88 31.43,35.88 40.01,44.45 IC2.38
  Bottom 0.152: IC1.38 IC2.38
N$1  (via drill 0.3)
  Top 0.152: LED1.2 v21.43,48.42
  Bottom 0.152: v21.43,48.42 21.43,48.11 22.23,47.31 R1.2
N$2  (via drill 0.3)
  Top 0.152: LED1.4 v23.02,45.55
  Bottom 0.152: v23.02,45.55 23.5,45.09 R2.2
N$3  (via drill 0.3)
  Top 0.152: LED1.3 v21.43,45.55
  Bottom 0.152: v21.43,45.55 20.95,45.09 R3.2
N$4  (via drill 0.3)
  Top 0.152: IC3.14 10.45,30.19 TP1.TP
  other vias: 11.43,29.21
N$5  (via drill 0.3)
  Top 0.152: IC3.63 16,23.93 arc-90 TDI.TP
  other vias: 16.19,24.13
N$6  (via drill 0.3)
  Top 0.152: IC3.65 17,25.86 TMS.TP
  other vias: 16.19,26.67
N$7  (via drill 0.3)
  Top 0.152: IC3.67 18,27.41 TCK.TP
  other vias: 16.19,29.21
N$8  (via drill 0.3)
  Top 0.152: IC3.122 14,38.07 14.92,37.15 15.88,37.15 TDO.TP
  other vias: 16.19,36.83
N$9  (via drill 0.3)
  Top 0.152: IC3.15 8.41,29.69 TP2.TP
  other vias: 8.89,29.21
Q  (via drill 0.3)
  Top 0.152: IC3.30 1.08,22.23 v2.86,22.23
  Bottom 0.152: IC1.35 IC2.35 40.01,36.83 39.69,36.51 39.69,34.61 28.26,23.18 3.81,23.18 v2.86,22.23
R/!W
  Top 0.152: IC2.32 40.01,29.21 36.51,32.7 24.77,32.7 24.75,32.69 IC3.100
R/!W'
  Top 0.152: IC1.32 41.27,30.48 40.01,30.48 37.47,33.02 24.45,33.02 24.28,33.19 IC3.101
RAM_A0  (via drill 0.3)
  Top 0.152: IC3.28 2.85,23.19 6.35,19.68 v6.35,19.37
  Bottom 0.152: IC6.5 6.55,19.17 v6.35,19.37
RAM_A1  (via drill 0.3)
  Top 0.152: IC3.31 3.71,21.69 5.4,20 v5.4,19.37
  Bottom 0.152: v5.4,19.37 5.75,19.02 IC6.4
RAM_A2  (via drill 0.3)
  Top 0.152: IC3.33 2.81,20.69 3.49,20 3.81,20 v4.45,19.37
  Bottom 0.152: v4.45,19.37 4.95,18.86 IC6.3
RAM_A3  (via drill 0.3)
  Top 0.152: IC3.34 2.67,20.19 v3.49,19.37
  Bottom 0.152: v3.49,19.37 4.15,18.71 IC6.2
RAM_A4  (via drill 0.3)
  Top 0.152: IC3.35 2.22,19.69 v2.54,19.37
  Bottom 0.152: v2.54,19.37 3.35,18.56 IC6.1
RAM_A5  (via drill 0.3)
  Top 0.152: IC3.38 3.5,3.18 v3.17,2.86
  Bottom 0.152: IC6.44 3.35,2.71 3.32,2.71 v3.17,2.86
RAM_A6  (via drill 0.3)
  Top 0.152: IC3.39 4,2.99 v4.13,2.86
  Bottom 0.152: v4.13,2.86 4.15,2.84 IC6.43
RAM_A7  (via drill 0.3)
  Top 0.152: IC3.40 4.5,3.44 v5.08,2.86
  Bottom 0.152: IC6.42 4.95,2.73 v5.08,2.86
RAM_A8  (via drill 0.3)
  Top 0.152: IC3.41 5,5.16 v7.3,2.86
  Bottom 0.152: v7.3,2.86 7.35,2.81 IC6.39
RAM_A9  (via drill 0.3)
  Top 0.152: v15.24,2.86 8.5,9.6 IC3.48
  Bottom 0.152: IC6.28 16.15,1.95 v15.24,2.86
RAM_A10  (via drill 0.3)
  Top 0.152: v16.19,2.86 9,10.05 IC3.49
  Bottom 0.152: IC6.27 16.95,2.1 v16.19,2.86
RAM_A11  (via drill 0.3)
  Top 0.152: v17.14,2.86 9.5,10.51 IC3.50
  Bottom 0.152: IC6.26 17.75,2.25 v17.14,2.86
RAM_A12  (via drill 0.3)
  Top 0.152: v18.1,2.86 10,10.96 IC3.51
  Bottom 0.152: IC6.25 18.55,2.41 v18.1,2.86
RAM_A13  (via drill 0.3)
  Top 0.152: v19.05,2.86 10.48,11.43 10.48,15.88 10.5,15.89 IC3.52
  Bottom 0.152: v19.05,2.86 19.35,2.56 IC6.24
RAM_A14  (via drill 0.3)
  Top 0.152: v20,2.86 10.79,12.06 10.79,15.56 11,15.76 IC3.53
  Bottom 0.152: v20,2.86 20.15,2.71 IC6.23
RAM_A15  (via drill 0.3)
  Top 0.152: IC3.16 7,29.19 v13.97,22.23
  Bottom 0.152: v13.97,22.23 20.15,16.05 IC6.22
RAM_A16  (via drill 0.3)
  Top 0.152: IC3.17 6.55,28.69 v13.97,21.27
  Bottom 0.152: v13.97,21.27 19.35,15.89 IC6.21
RAM_A17  (via drill 0.3)
  Top 0.152: IC3.19 6.6,27.69 v13.97,20.32
  Bottom 0.152: v13.97,20.32 18.55,15.74 IC6.20
RAM_A18  (via drill 0.3)
  Top 0.152: IC3.20 6.15,27.19 v13.97,19.37
  Bottom 0.152: v13.97,19.37 17.75,15.59 IC6.19
RAM_A19  (via drill 0.3)
  Top 0.152: IC3.21 5.7,26.69 v13.02,19.37
  Bottom 0.152: v13.02,19.37 16.95,15.44 IC6.18
RAM_A20  (via drill 0.3)
  Top 0.152: IC3.23 4.79,25.69 v11.11,19.37
  Bottom 0.152: v11.11,19.37 15.35,15.13 IC6.16
RAM_D0  (via drill 0.3)
  Top 0.152: IC3.27 2.98,23.69 v7.3,19.37
  Bottom 0.152: v7.3,19.37 9.75,16.92 IC6.9
RAM_D1  (via drill 0.3)
  Top 0.152: IC3.26 3.43,24.19 v8.26,19.37
  Bottom 0.152: v8.26,19.37 10.55,17.07 IC6.10
RAM_D2  (via drill 0.3)
  Top 0.152: IC3.25 3.88,24.69 v9.21,19.37
  Bottom 0.152: v9.21,19.37 12.95,15.63 IC6.13
RAM_D3  (via drill 0.3)
  Top 0.152: IC3.24 4.34,25.19 v10.16,19.37
  Bottom 0.152: v10.16,19.37 13.75,15.78 IC6.14
RAM_D4  (via drill 0.3)
  Top 0.152: IC3.46 7.5,16.63 7.62,16.51 7.62,8.89 v13.65,2.86
  Bottom 0.152: IC6.31 13.75,2.76 v13.65,2.86
RAM_D5  (via drill 0.3)
  Top 0.152: IC3.45 7,16.5 7.3,16.19 7.3,8.26 v12.7,2.86
  Bottom 0.152: v12.7,2.86 12.95,2.61 IC6.32
RAM_D6  (via drill 0.3)
  Top 0.152: IC3.44 6.5,16.36 6.99,15.88 6.99,6.35 v10.48,2.86
  Bottom 0.152: v10.48,2.86 10.55,2.79 IC6.35
RAM_D7  (via drill 0.3)
  Top 0.152: v9.53,2.86 6.67,5.71 6.67,15.56 6,16.23 IC3.43
  Bottom 0.152: v9.53,2.86 9.75,2.63 IC6.36
TAG_A0  (via drill 0.3)
  Top 0.152: IC3.124 13,39.98 13.65,40.64 IC4.10 v13.65,46.67
  Bottom 0.152: v13.65,46.67 IC5.10
TAG_A1  (via drill 0.3)
  Top 0.152: IC3.126 12,40.26 12.38,40.64 IC4.9 v12.38,46.67
  Bottom 0.152: v12.38,46.67 IC5.9
TAG_A2  (via drill 0.3)
  Top 0.152: IC3.129 10.5,40.02 11.11,40.64 IC5.21 v11.11,42.23
  Bottom 0.152: v11.11,42.23 IC5.21
TAG_A3  (via drill 0.3)
  Top 0.152: IC3.131 9.5,40.3 9.84,40.64 IC4.7 v9.84,46.67
  Bottom 0.152: v9.84,46.67 IC5.7
TAG_A4  (via drill 0.3)
  Top 0.152: IC3.133 8.5,40.56 8.57,40.64 IC5.23 v8.57,42.23
  Bottom 0.152: v8.57,42.23 IC5.23
TAG_A5  (via drill 0.3)
  Top 0.152: IC3.135 7.5,40.45 7.3,40.64 IC5.24 v7.3,42.23
  Bottom 0.152: v7.3,42.23 IC5.24
TAG_A6  (via drill 0.3)
  Top 0.152: IC3.137 6.5,40.17 6.03,40.64 IC5.25 v6.03,42.23
  Bottom 0.152: v6.03,42.23 IC5.25
TAG_A7  (via drill 0.3)
  Top 0.152: IC3.139 5.5,39.91 4.76,40.64 IC5.26 v4.76,42.23
  Bottom 0.152: v4.76,42.23 IC5.26
TAG_A8  (via drill 0.3)
  Top 0.152: IC3.136 7,40.31 6.67,40.64 6.67,46.99 6.03,47.62 IC5.4 v6.03,49.21
  Bottom 0.152: v6.03,49.21 IC5.4
TAG_A9  (via drill 0.3)
  Top 0.152: IC3.134 8,40.58 7.94,40.64 7.94,46.99 7.3,47.62 IC5.5 v7.3,49.21
  Bottom 0.152: v7.3,49.21 IC5.5
TAG_A10  (via drill 0.3)
  Top 0.152: IC3.128 11,39.89 11.75,40.64 11.75,46.99 11.11,47.62 IC5.8 v11.11,49.21
  Bottom 0.152: v11.11,49.21 IC5.8
TAG_A11  (via drill 0.3)
  Top 0.152: IC3.132 9,40.43 9.21,40.64 9.21,46.99 8.57,47.62 IC5.6 v8.57,49.21
  Bottom 0.152: v8.57,49.21 IC5.6
TAG_A12  (via drill 0.3)
  Top 0.152: IC3.142 4,40.13 3.49,40.64 IC4.2 v3.49,46.67
  Bottom 0.152: v3.49,46.67 IC5.2
TAG_A13  (via drill 0.3)
  Top 0.152: IC3.138 6,40.04 5.4,40.64 5.4,46.99 4.76,47.62 IC5.3 v4.76,49.21
  Bottom 0.152: v4.76,49.21 IC5.3
TAG_A14  (via drill 0.3)
  Top 0.152: IC3.143 3.5,39.37 2.22,40.64 IC4.1 v2.22,46.67
  Bottom 0.152: v2.22,46.67 IC5.1
TAG_D0
  Top 0.152: IC3.120 15,40.56 14.92,40.64 IC4.11
TAG_D1
  Top 0.152: IC3.118 16,40.45 16.19,40.64 IC4.12
TAG_D2
  Top 0.152: IC3.116 17,40.17 17.46,40.64 IC4.13
TAG_D3
  Top 0.152: IC3.115 17.5,40.04 18.1,40.64 18.1,46.99 18.73,47.62 IC4.15
TAG_D4
  Top 0.152: IC3.117 16.5,40.31 16.83,40.64 16.83,46.99 17.46,47.62 IC4.16
TAG_D5
  Top 0.152: IC3.119 15.5,40.58 15.56,40.64 15.56,46.99 16.19,47.62 IC4.17
TAG_D6
  Top 0.152: IC3.121 14.5,40.43 14.29,40.64 14.29,46.99 14.92,47.62 IC4.18
TAG_D7
  Top 0.152: IC3.125 12.5,40.12 13.02,40.64 13.02,46.99 13.65,47.62 IC4.19
TAG_D8  (via drill 0.3)
  Top 0.152: IC3.3 1.72,35.69 1.91,35.88 11.43,35.88 v12.06,36.51
  Bottom 0.152: v12.06,36.51 14.29,38.73 14.29,46.99 14.92,47.62 IC5.11
TAG_D9  (via drill 0.3)
  Top 0.152: IC3.5 1.99,34.69 2.54,35.24 12.7,35.24 v13.97,36.51
  Bottom 0.152: IC5.12 16.19,47.62 15.56,46.99 15.56,38.1 v13.97,36.51
TAG_D10  (via drill 0.3)
  Top 0.152: v16.19,35.88 14.92,34.61 3.17,34.61 2.26,33.69 IC3.7
  Bottom 0.152: IC5.13 17.46,47.62 16.83,46.99 16.83,36.51 v16.19,35.88
TAG_D11  (via drill 0.3)
  Top 0.152: IC3.10 5.2,32.19 5.71,32.7 16.19,32.7 17.78,34.29 v17.78,36.51
  Bottom 0.152: IC5.15 18.73,40.64 17.78,39.69 v17.78,36.51
TAG_D12  (via drill 0.3)
  Top 0.152: IC3.9 5.07,32.69 5.4,33.02 15.88,33.02 17.14,34.29 v17.14,35.88
  Bottom 0.152: IC5.16 17.46,40.64 17.14,40.32 v17.14,35.88
TAG_D13  (via drill 0.3)
  Top 0.152: IC3.6 2.12,34.19 2.86,34.92 13.34,34.92 v14.92,36.51
  Bottom 0.152: IC5.17 16.19,37.78 v14.92,36.51
TAG_D14  (via drill 0.3)
  Top 0.152: IC3.4 1.85,35.19 2.22,35.56 12.06,35.56 v13.02,36.51
  Bottom 0.152: v13.02,36.51 14.92,38.42 IC5.18
TAG_D15  (via drill 0.3)
  Top 0.152: IC3.2 10.79,36.19 v11.11,36.51
  Bottom 0.152: IC5.19 13.65,39.05 v11.11,36.51
TSC
  Top 0.152: IC2.39 40.01,46.99 36.2,43.18 23.81,43.18 20,39.37 IC3.110
  Bottom 0.152: IC1.39 IC2.39
VCC
  Bottom 0.61: IC2.7 IC1.7 27.32,34.27 C1.1.1 31.75,34.27 | IC8.3 31.75,36.27 31.75,34.27 | 31.75,34.27 C3.1